# EAGLE design myQT_nRF52840_Board (EAGLE 9.6.2)
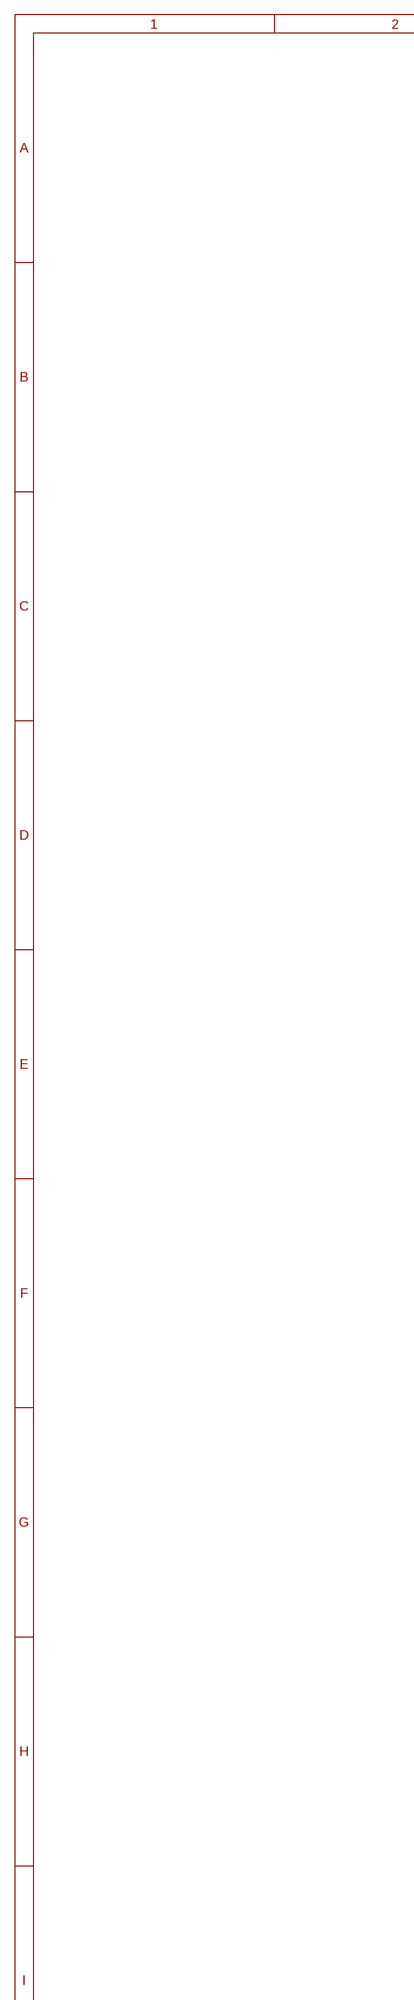
[diagram p0: schematic, sheet 1, part 1 of 2]
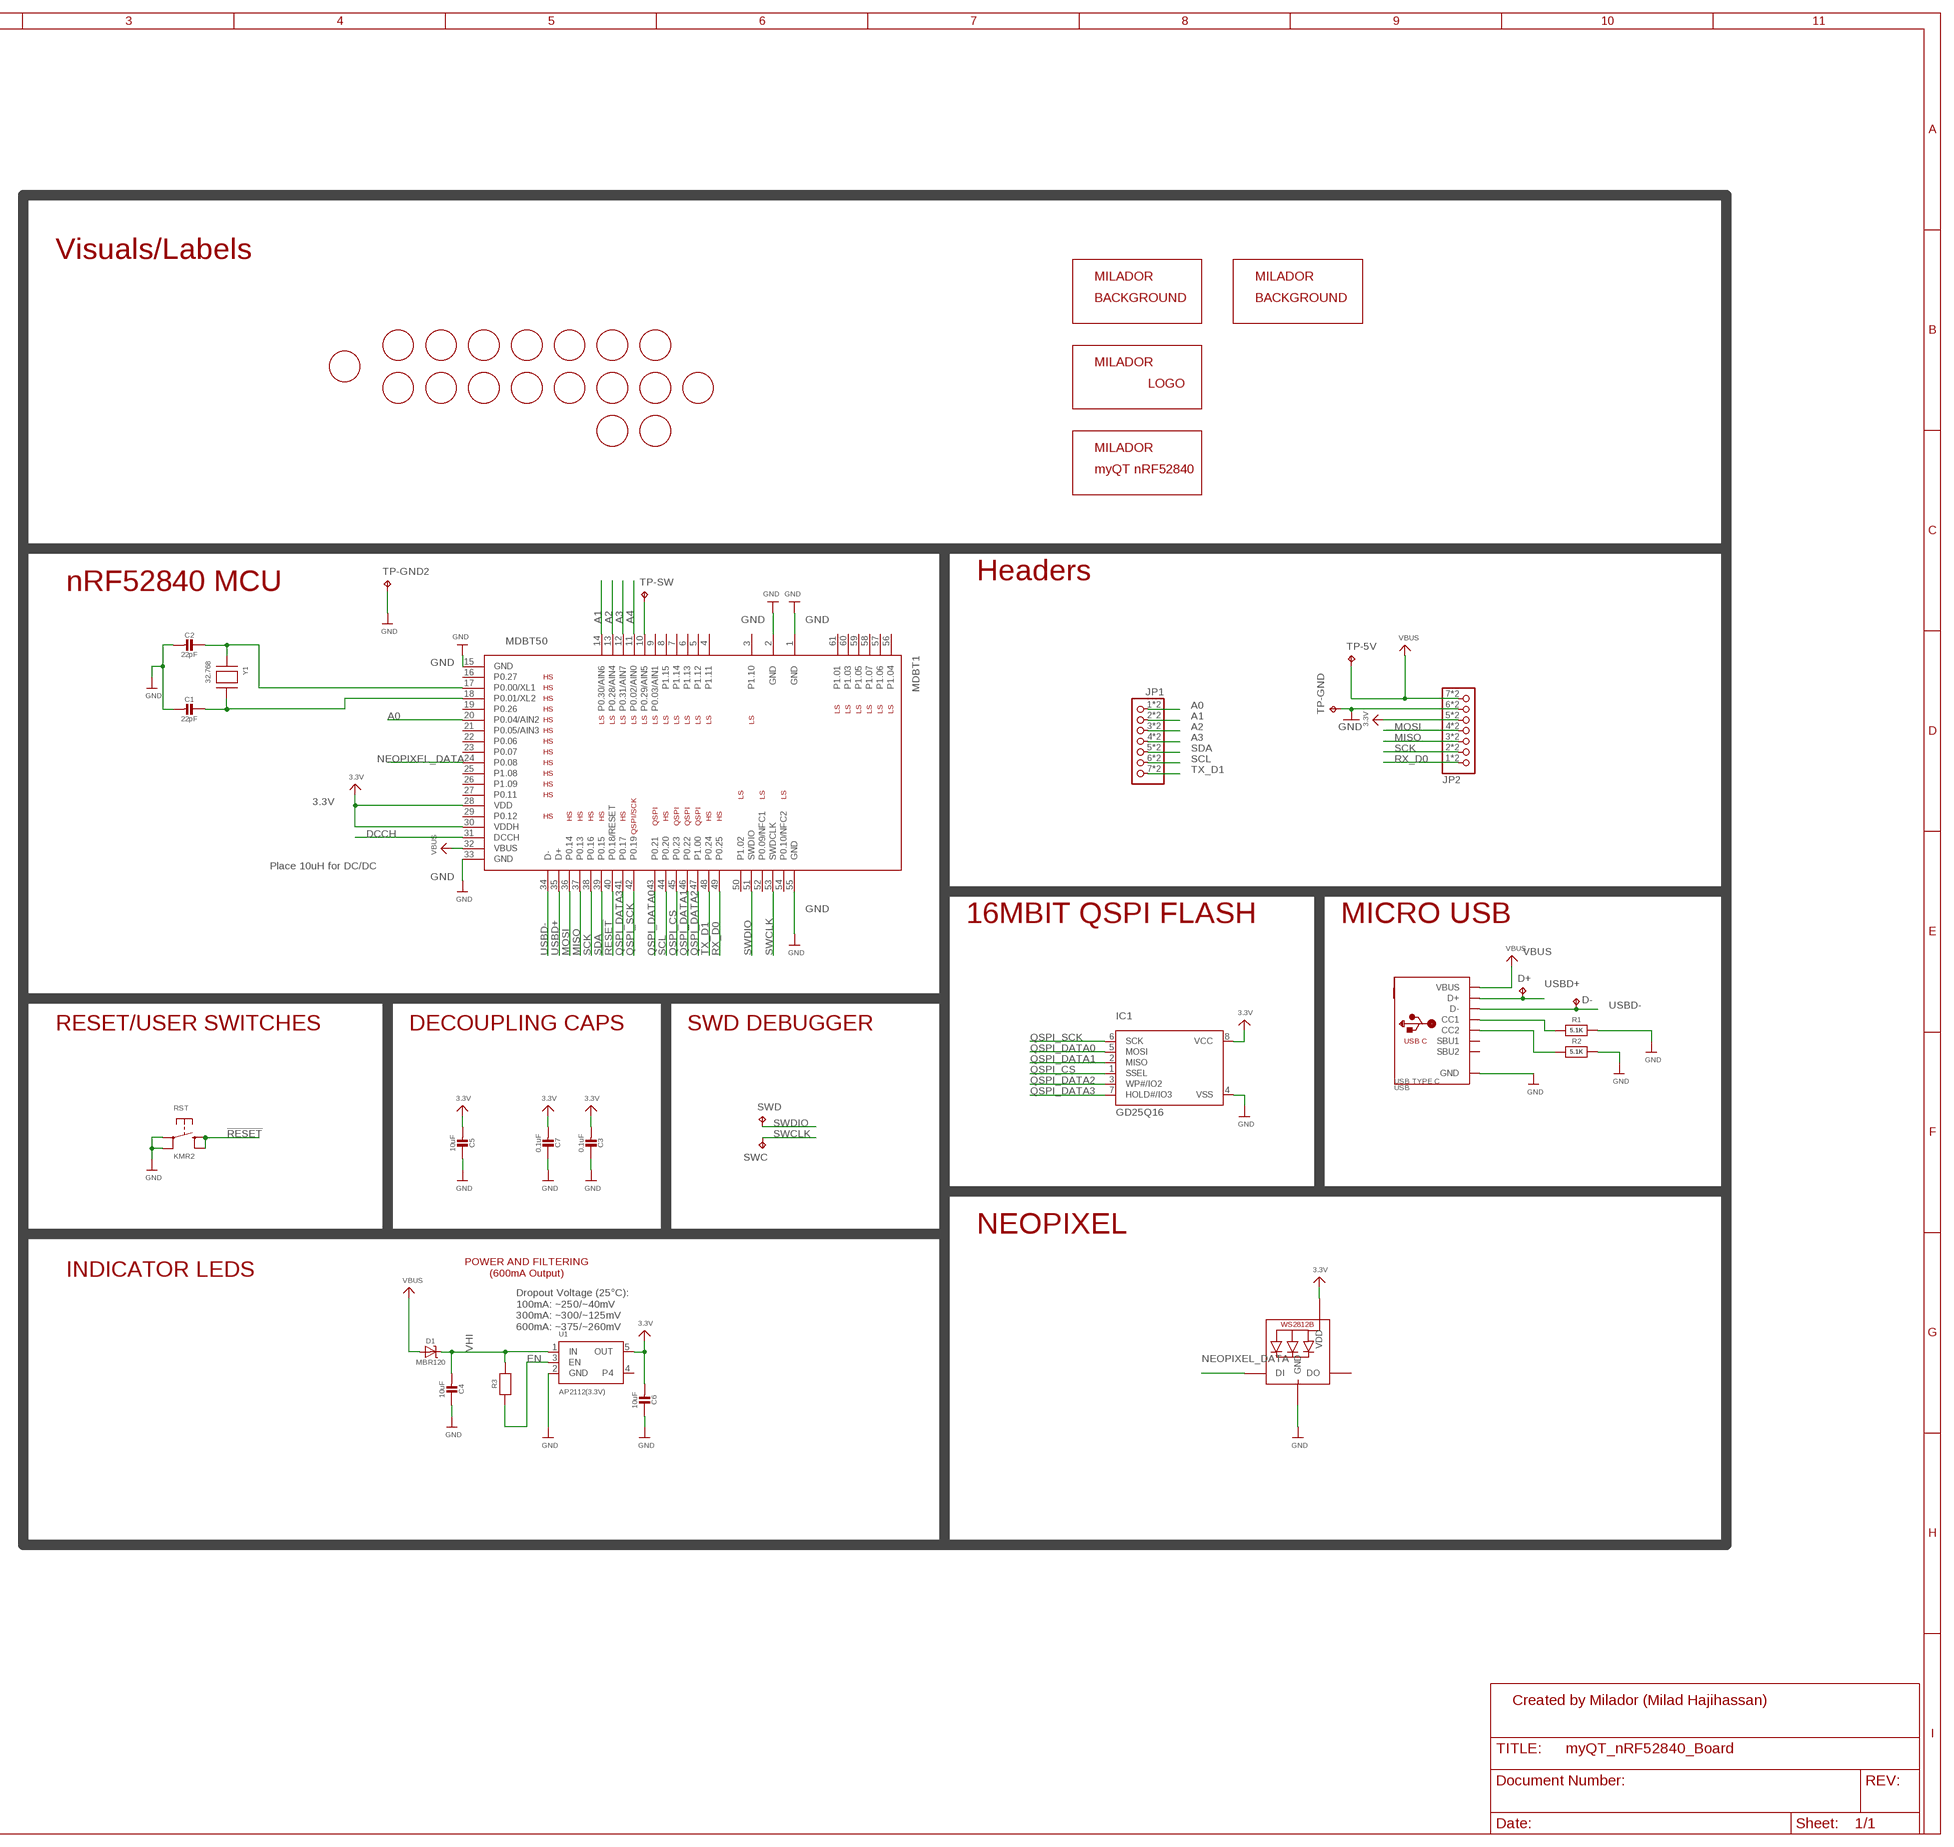
[diagram p1: schematic, sheet 1, part 2 of 2]

## Parts
C1  22pF  CAP_CERAMIC-0603MP  [0603-MP]
C2  22pF  CAP_CERAMIC-0603MP  [0603-MP]
C3  0.1uF  CAP_CERAMIC-0603-NO  [0603-NO]
C4  10uF  CAP_CERAMIC-0805-NOOUTLINE  [0805-NO]
C5  10uF  CAP_CERAMIC-0805-NOOUTLINE  [0805-NO]
C6  10uF  CAP_CERAMIC-0805-NOOUTLINE  [0805-NO]
C7  0.1uF  CAP_CERAMIC-0603-NO  [0603-NO]
D1  MBR120  DIODE-SCHOTTKYSOD-123  [SOD-123]
D+  TESTPAD_TPTP10R  [TESTPAD_TP10R]
D-  TESTPAD_TPTP10R  [TESTPAD_TP10R]
IC1  GD25Q16  SPIFLASH_8PINUX  [USON8]
JP1  HEADER-1X7_CASTEL  [1X07_CASTEL]
JP2  HEADER-1X7_CASTEL  [1X07_CASTEL]
LED  WS2812B_SK6805_1515  [SK6805_1515]
MDBT1  MDBT50  [MDBT50]
R1  5.1K  RESISTOR-0402-NO  [0402-NO]
R2  5.1K  RESISTOR-0402-NO  [0402-NO]
R3  10K  RESISTOR-0603-NOOUT  [0603-NO]
RST  KMR2  SWITCH_TACT_SMT4.6X2.8  [BTN_KMR2_4.6X2.8]
SWC  TESTPAD_TPTP13R  [TESTPAD_TP13R]
SWD  TESTPAD_TPTP13R  [TESTPAD_TP13R]
TP-5V  TESTPAD_TPB1,27  [TESTPAD_B1,27]
TP-GND  TESTPAD_TPB1,27  [TESTPAD_B1,27]
TP-GND2  TESTPAD_TPTP06R  [TESTPAD_TP06R]
TP-SW  TESTPAD_TPTP06R  [TESTPAD_TP06R]
U1  AP2112(3.3V)  VREG_SOT23-5  [SOT23-5]
U$6  MILADOR-PIN-NAME-A0  [PIN-A0]
U$7  MILADOR-PIN-NAME-5V  [PIN-5V]
U$10  MILADOR-PIN-NAME-GND  [PIN-GND]
U$12  MILADOR-PIN-NAME-3V  [PIN-3V]
U$14  MILADOR-PIN-NAME-MO2  [PIN-MO2]
U$18  MILADOR-PIN-NAME-MI2  [PIN-MI2]
U$20  MILADOR-PIN-NAME-SCK2  [PIN-SCK2]
U$24  MILADOR-PIN-NAME-RX  [PIN-RX]
U$25  MILADOR-PIN-NAME-A1  [PIN-A1]
U$26  MILADOR-PIN-NAME-A2  [PIN-A2]
U$27  MILADOR-PIN-NAME-A3  [PIN-A3]
U$28  MILADOR-PIN-NAME-TX  [PIN-TX]
U$29  MILADOR-PIN-NAME-SDA2  [PIN-SDA2]
U$33  MILADOR-PIN-NAME-SCL2  [PIN-SCL2]
U$36  MILADOR-PIN-NAME-RST  [PIN-RST]
U$37  MILADOR-BACKGROUND-VANCOUVER  [MILADOR_BG_VAN]
U$38  MILADOR-DEVICE-  [MILADOR_MYQT_NRF52840]
U$39  MILADOR-LOGO-  [MILADOR_LOGO1]
U$40  MILADOR-BACKGROUND-CANADA_SM  [MILADOR_BG_CAN_SM]
U$41  MILADOR-PIN-NAME-D+  [PIN-D+]
U$43  MILADOR-PIN-NAME-D-  [PIN-D-]
U$44  MILADOR-PIN-NAME-SW  [PIN-SW]
USB  USB TYPE C  USB_C  [USB_C_CUSB31-CFM2AX-01-X]
Y1  32.768  ADAFRUIT2_XTAL-3.2X1.5  [ADAFRUIT2_XTAL3215]

## Nets
3.3V [power]: C3.2 C5.2 C6.2 C7.2 IC1.8(VCC) JP2.5 JP2.5C LED.2(VDD) MDBT1.28(VDD) MDBT1.30(VDDH) U1.5(OUT)
!RESET: MDBT1.40(P0.18/RESET) RST.B'(S1) RST.B(S)
A0: JP1.1 JP1.1C MDBT1.20(P0.04/AIN2)
A1: JP1.2 JP1.2C MDBT1.14(P0.30/AIN6)
A2: JP1.3 JP1.3C MDBT1.13(P0.28/AIN4)
A3: JP1.4 JP1.4C MDBT1.12(P0.31/AIN7)
A4: MDBT1.11(P0.02/AIN0)
DCCH: MDBT1.31(DCCH)
EN: R3.1 U1.3(EN)
GND [power]: C1.2 C2.2 C3.1 C4.1 C5.1 C6.1 C7.1 IC1.4(VSS) JP2.6 JP2.6C LED.4(GND) MDBT1.1(GND) MDBT1.2(GND) MDBT1.15(GND) MDBT1.33(GND) MDBT1.55(GND) R1.2 R2.2 RST.A'(P1) RST.A(P) TP-GND2.TP TP-GND.TP U1.2(GND) USB.A1B12(GND) USB.B1A12(GND)
MISO: JP2.3 JP2.3C MDBT1.37(P0.13)
MOSI: JP2.4 JP2.4C MDBT1.36(P0.14)
N$1: MDBT1.10(P0.29/AIN5) TP-SW.TP
N$3: R1.1 USB.A5(CC1)
N$4: R2.1 USB.B5(CC2)
N$7: C2.1 MDBT1.17(P0.00/XL1) Y1.P$1
N$8: C1.1 MDBT1.18(P0.01/XL2) Y1.P$2
NEOPIXEL_DATA: LED.1(DI) MDBT1.24(P0.08)
QSPI_CS: IC1.1(SSEL) MDBT1.45(P0.23)
QSPI_DATA0: IC1.5(MOSI) MDBT1.43(P0.21)
QSPI_DATA1: IC1.2(MISO) MDBT1.46(P0.22)
QSPI_DATA2: IC1.3(WP#/IO2) MDBT1.47(P1.00)
QSPI_DATA3: IC1.7(HOLD#/IO3) MDBT1.41(P0.17)
QSPI_SCK: IC1.6(SCK) MDBT1.42(P0.19)
RX_D0: JP2.1 JP2.1C MDBT1.49(P0.25)
SCK: JP2.2 JP2.2C MDBT1.38(P0.16)
SCL: JP1.6 JP1.6C MDBT1.44(P0.20)
SDA: JP1.5 JP1.5C MDBT1.39(P0.15)
SWCLK: MDBT1.53(SWDCLK) SWC.TP
SWDIO: MDBT1.51(SWDIO) SWD.TP
TX_D1: JP1.7 JP1.7C MDBT1.48(P0.24)
USBD+: D+.TP MDBT1.35(D+) USB.A6(D+) USB.B6(D+)
USBD-: D-.TP MDBT1.34(D-) USB.A7(D-) USB.B7(D-)
VBUS [power]: D1.A JP2.7 JP2.7C MDBT1.32(VBUS) TP-5V.TP USB.A4B9(VBUS) USB.B4A9(VBUS)
VHI [power]: C4.2 D1.C R3.2 U1.1(IN)
Unconnected: LED.3(DO) MDBT1.3(P1.10) MDBT1.4(P1.11) MDBT1.5(P1.12) MDBT1.6(P1.13) MDBT1.7(P1.14) MDBT1.8(P1.15) MDBT1.9(P0.03/AIN1) MDBT1.16(P0.27) MDBT1.19(P0.26) MDBT1.21(P0.05/AIN3) MDBT1.22(P0.06) MDBT1.23(P0.07) MDBT1.25(P1.08) MDBT1.26(P1.09) MDBT1.27(P0.11) MDBT1.29(P0.12) MDBT1.50(P1.02) MDBT1.52(P0.09/NFC1) MDBT1.54(P0.10/NFC2) MDBT1.56(P1.04) MDBT1.57(P1.06) MDBT1.58(P1.07) MDBT1.59(P1.05) MDBT1.60(P1.03) MDBT1.61(P1.01) U1.4 USB.A8(SBU1) USB.B8(SBU2)

## Notes on the sheet
- Visuals/Labels
- Headers
- nRF52840 MCU
- Place 10uH for DC/DC
- 16MBIT QSPI FLASH | MICRO USB
- RESET/USER SWITCHES | DECOUPLING CAPS | SWD DEBUGGER
- NEOPIXEL
- INDICATOR LEDS
- POWER AND FILTERING
  (600mA Output)
- Dropout Voltage (25°C):
  100mA: ~250/~40mV
  300mA: ~300/~125mV
  600mA: ~375/~260mV
- Created by Milador (Milad Hajihassan)

## Library data of the parts
C1-C7 = milador_SMD:CAP_CERAMIC-: Ceramic Capacitors For new designs, use the packages preceded by an '_' character since they are more reliable: The following footprints should be used on most boards: _0402 - Standard footprint for regular board layouts _0603 - Standard footprint for regular board layouts _0805 - Standard footprint for regular board layouts _1206 - Standard footprint for regular board layouts For extremely tight-pitch boards where space is at a premium, the following 'micro-pitch' footprints can be used (smaller pads, no silkscreen outline, etc.): _0402MP - Micro-pitch footprint for very dense/compact boards _0603MP - Micro-pitch footprint for very dense/compact boards _0805MP - Micro-pitch footprint for very dense/compact boards _1206MP - Micro-pitch footprint for very dense/compact boards
D1 = milador_SMD:DIODE-SCHOTTKY
D+ D- SWC SWD TP-5V TP-GND TP-GND2 TP-SW = milador_SMD:TESTPAD_TP: Test pad
IC1 = milador_SMD:SPIFLASH_8PIN: SOIC8 SPI Flash Be careful with the size since SOIC8 flash comes in several 'widths' SOIC8 150 mil M25P16 - 16Mbit (2Mbit x 8) Serial Flash (75MHz SPI Bus), Supply: 2.7-3.6V Digikey: SOIC8 - M25P16-VMN6P-ND SOIC8 208 mil W25Q16BVSSIG - 16Mbit (2Mbit x 8) Serial Flash (104MHz SPI Bus), Supply: 2.7-3.6V Digikey: SOIC8 - W25Q16BVSSIG-ND
JP1 JP2 = milador:HEADER-1X7: PIN HEADER
LED = milador_SMD:WS2812B
MDBT1 = milador_SMD:MDBT50: Raytac Corporation MDBT50 Bluetooth Low Energy Module based on Noridc nRF52840 Source: Raytac datasheet
R1-R3 = milador_SMD:RESISTOR-: Resistors For new designs, use the packages preceded by an '_' character since they are more reliable: The following footprints should be used on most boards: _0402 - Standard footprint for regular board layouts _0603 - Standard footprint for regular board layouts _0805 - Standard footprint for regular board layouts _1206 - Standard footprint for regular board layouts For extremely tight-pitch boards where space is at a premium, the following 'micro-pitch' footprints can be used (smaller pads, no silkscreen outline, etc.): _0402MP - Micro-pitch footprint for very dense/compact boards _0603MP - Micro-pitch footprint for very dense/compact boards _0805MP - Micro-pitch footprint for very dense/compact boards _1206MP - Micro-pitch footprint for very dense/compact boards
RST = milador_SMD:SWITCH_TACT_SMT: SMT Tact Switches 6x6mm - Digikey: P12940SCT-ND KMR2 (4.6x2.8mm) - Digikey: 401-1426-1-ND EVQ-PQHB55 - Light Touch, 160GF (4.5x4.5mm) - Digikey: P8090SCT-ND KMT0 - KMT021 NGJ LHS (etc.) IP68/Waterproof - Digikey: CKN10289CT-ND
U1 = milador_SMD:VREG_SOT23-5: SOT23-5 Fixed Voltage Regulators Part Current Out V Out V In V Dropout θJA (°C/W) TJ (°C) Digikey Part No. ADP121 150mA 3.3V 3.4-5.5V 0.09V @ 150mA -- -- ADP121-AUJZ33R7CT-ND ADP121 150mA 3.0V 3.1-5.5V 0.09V @ 150mA -- -- ADP121-AUJZ30R7CT-ND ADP122 300mA 3.3V 3.4-5.5V 0.085V @ 300mA -- -- ADP122AUJZ-3.3-R7CT-ND ADP1712 300mA 3.3V 3.5-5.5V 0.17V @ 300mA -- -- ADP1712AUJZ-3.3-R7TR-ND AP7311 (Low Cost) 150mA 3.3V 3.5-6V 0.15V @ 150mA -- -- AP7311-33WG-7DICT-ND LD39015M18R 150mA 1.8V 1.9V-5.5V 0.08V @ 100mA -- -- 497-6977-1-ND LP2985A-33DBVR 150mA 3.3V 3.3-16V 0.28V @ 150mA 206 150 296-18479-1-ND MCP1824T-3302E/OT 300mA 3.3V 3.5V-6V 0.2V @ 300mA -- -- MCP1824T-3302E/OTCT-ND MIC5205-2.5YM5 TR 150mA 2.5V 2.7-16V 0.165V @ 150mA -- -- 576-1257-2-ND MIC5205-3.0YM5 TR 150mA 3.0V 3.2V-16V 0.165V @ 150mA -- -- 576-1258-2-ND MIC5205-3.3YM5 TR 150mA 3.3V 3.5V-16V 0.165V @ 150mA -- -- 576-1259-2-ND TPS780330220 150mA 3.3V+2.2V 3.6-5.5V 250mV Max -- -- 296-23332-1-ND TDA3663/N1,135 100mA 3.3V 3.5-45V 0.18V @ 50mA -- -- 568-5343-1-ND Max operating temp can be calculated using θJA, TJ (max junction temperature), and power in watts. Set the "Maximum Ambient Temperature" until it reaches TJ ("Max Junction Temperature"), which is the absolute limit for safe use of the regulator: Heat Sink Temperature Calculator <http://www.daycounter.com/Calculators/Heat-Sink-Temperature-Calculator.phtml> For example, With 12V source into a 3.3V LP2985 and a 30mA load, we are dissipating (12V-3.3V) * 0.03A = 0.261W. With a θJA of 206 °C/W, a TJ of 150°C, and 261mW we can safely use the chip without a heat sink up to 75°C (=147.1°C Junction Temperature).
U$6 U$7 U$10 U$12 U$14 U$18 U$20 U$24-U$29 U$33 U$36 U$41 U$43 U$44 = milador:MILADOR-PIN-NAME-
U$37 U$40 = milador:MILADOR-BACKGROUND-
U$38 = milador:MILADOR-DEVICE-
U$39 = milador:MILADOR-LOGO-
USB = milador_SMD:USB_C: USB Type-C USB 2.0 Connector
Y1 = milador_SMD:ADAFRUIT2_XTAL: Low cost SMT crystals, no capacitors included http://www.ladyada.net/library/eagle

## Net classes
1 power: width 0.254 mm

## Board
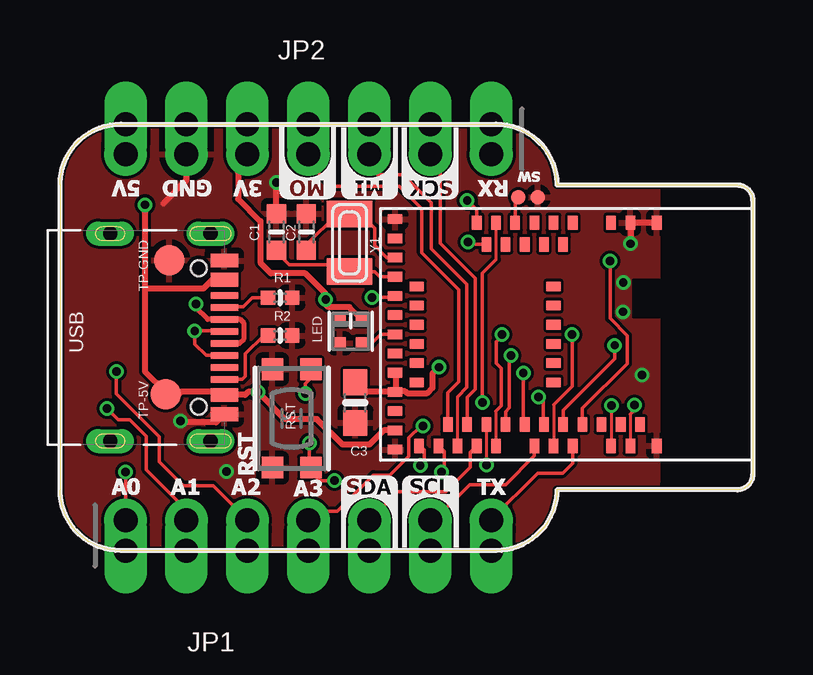
[diagram p2: board, top side]
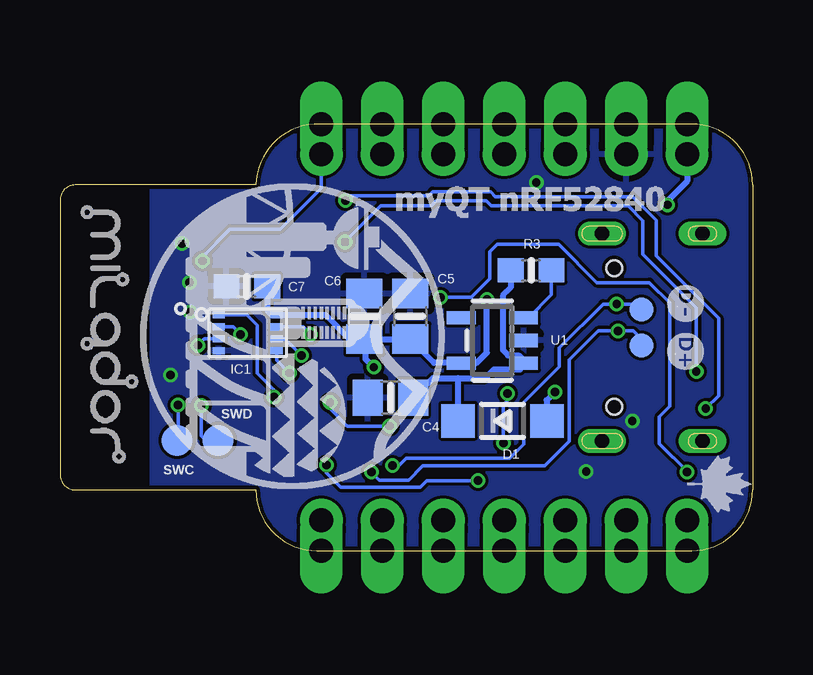
[diagram p3: board, bottom side, seen from below]

Size 28.86 x 17.78 mm. Coordinates in mm from the lower left corner, seen from the top.
Outline: 0,15.24 arc-90 2.54,17.78 18.03,17.78 arc-90 20.7,15.24 28.23,15.24 arc-90 28.86,14.61 28.86,3.17 arc-90 28.23,2.54 20.7,2.54 arc-90 18.16,0 2.54,0 arc-90 0,2.54 0,15.24
Copper layers (1*16): Top 0.035mm / dielectric 1.5mm / Bottom 0.035mm
Design rules "SparkFun-2-Layer-Minimum-JLCPCB": minimum track width 5mil, minimum drill 0.3mm, track to track 5mil, track to pad 5mil, pad to pad 5mil, via to via 5mil, smd to smd 5mil, copper to edge 7mil, drill to drill 7mil, minimum pad ring 5mil, minimum via ring 5mil, stop-mask expansion 2.5mil, vias tented up to drill 25mil, thermal gap 10mil

### Footprints (pad centres in the part's own frame; a part is rotated, then mirrored left to right if it is on the bottom)
0603-MP = smd 0.8 x 0.8: 1 -0.762,0; 2 0.762,0
0603-NO = smd 1.075 x 1: 1 -0.85,0; 2 0.85,0
0805-NO = smd 1.24 x 1.5: 1 -0.95,0; 2 0.95,0
SOD-123 = smd 1.4 x 1.4: A 1.85,0; C -1.85,0
TESTPAD_TP10R = smd 1 x 1: TP 0,0
USON8 = smd 0.5 x 0.275: 1 -1.2,0.75; 2 -1.2,0.25; 3 -1.2,-0.25; 4 -1.2,-0.75; 5 1.2,-0.75; 6 1.2,-0.25; 7 1.2,0.25; 8 1.2,0.75
1X07_CASTEL = drill 1 pad 1.778: 1 -7.62,0; 2 -5.08,0; 3 -2.54,0; 4 0,0; 5 2.54,0; 6 5.08,0; 7 7.62,0 | drill 1 pad 1.778 long: 1C -7.62,-1.27; 2C -5.08,-1.27; 3C -2.54,-1.27; 4C 0,-1.27; 5C 2.54,-1.27; 6C 5.08,-1.27; 7C 7.62,-1.27
SK6805_1515 = smd 0.5 x 0.5: 1 -0.5,-0.45; 2 0.5,-0.45; 3 0.5,0.45; 4 -0.5,0.45
MDBT50 = smd 0.6 x 0.4: 1 -4.65,3.75; 2 -4.65,2.65; 3 -4.65,1.85; 4 -4.65,0.25; 5 -3.75,-0.15; 6 -4.65,-0.55; 7 -3.75,-0.95; 8 -4.65,-1.35; 9 -3.75,-1.75; 10 -4.65,-2.15; 11 -3.75,-2.55; 12 -4.65,-2.95; 13 -3.75,-3.35; 14 -4.65,-3.75; 34 4.65,-6.15; 35 4.65,-5.35; 36 3.75,-4.95; 37 4.65,-4.55; 38 3.75,-4.15; 39 4.65,-3.75; 40 3.75,-3.35; 41 4.65,-2.95; 42 3.75,-2.55; 43 3.75,-1.75; 44 4.65,-1.35; 45 3.75,-0.95; 46 4.65,-0.55; 47 3.75,-0.15; 48 4.65,0.25; 49 3.75,0.65; 50 3.75,1.45; 51 4.65,1.85; 52 3.75,2.25; 53 4.65,2.65; 54 3.75,3.05; 55 4.65,3.75 | smd 0.4 x 0.6: 15 -4.8,-7.15; 16 -4,-7.15; 17 -3.2,-7.15; 18 -2.4,-7.15; 19 -2,-6.25; 20 -1.6,-7.15; 21 -1.2,-6.25; 22 -0.8,-7.15; 23 -0.4,-6.25; 24 0,-7.15; 25 0.4,-6.25; 26 0.8,-7.15; 27 1.2,-6.25; 28 1.6,-7.15; 29 2,-6.25; 30 2.4,-7.15; 31 3.2,-7.15; 32 4,-7.15; 33 4.8,-7.15; 56 -2,-0.55; 57 -1.2,-0.55; 58 -0.4,-0.55; 59 0.4,-0.55; 60 1.2,-0.55; 61 2,-0.55
0402-NO = smd 0.6 x 0.6: 1 -0.508,0; 2 0.508,0
BTN_KMR2_4.6X2.8 = smd 0.9 x 0.9: A 2.05,0.8; A' -2.05,0.8; B 2.05,-0.8; B' -2.05,-0.8
TESTPAD_TP13R = smd 1.3 x 1.3: TP 0,0
TESTPAD_B1,27 = smd 1.27 x 1.27: TP 0,0
TESTPAD_TP06R = smd 0.6 x 0.6: TP 0,0
SOT23-5 = smd 0.55 x 1.2: 1 -0.95,-1.3; 2 0,-1.3; 3 0.95,-1.3; 4 0.95,1.3; 5 -0.95,1.3
USB_C_CUSB31-CFM2AX-01-X = smd 0.575 x 1.15: A1B12 -3.2,3.545; A4B9 -2.4,3.545; B1A12 3.2,3.545; B4A9 2.4,3.545 | smd 0.275 x 1.15: A5 -1.25,3.545; A6 -0.25,3.545; A7 0.25,3.545; A8 1.25,3.545; B5 1.75,3.545; B6 0.75,3.545; B7 -0.75,3.545; B8 -1.75,3.545 | drill 0.6 pad 1 long: M1 -4.32,2.97; M2 4.32,2.97; M3 -4.32,-1.21; M4 4.32,-1.21 | hole 0.65: 2.89,2.47; -2.89,2.47
ADAFRUIT2_XTAL3215 = smd 1.1 x 1.9: P$1 1.2,0; P$2 -1.2,0

### Placement (x,y rotation side)
C1  9.02,13.28 90 top
C2  10.27,13.28 90 top
C3  12.31,6.17 90 top
C4  15.09,6.38 0 bottom
C5  14.27,9.77 270 bottom
C6  16.17,9.77 270 bottom
C7  21.08,11.01 0 bottom
D1  10.42,5.41 0 bottom
D+  4.62,8.56 0 bottom
D-  4.62,10.06 0 bottom
IC1  21.04,9.08 0 bottom
JP1  10.35,1.27 0 top
JP2  10.35,16.51 180 top
LED  12.12,9.14 90 top
MDBT1  21.11,9.02 270 top
R1  9.17,10.54 0 top
R2  9.17,8.97 0 top
R3  9.23,11.69 180 bottom
RST  9.65,5.51 90 top
SWC  23.98,4.6 270 bottom
SWD  22.27,4.6 0 bottom
TP-5V  4.4,6.52 0 top
TP-GND  4.55,12.1 0 top
TP-GND2  19.91,14.73 0 top
TP-SW  19.1,14.73 0 top
U1  10.85,8.76 90 bottom
U$6  2.73,2.34 0 top
U$7  2.72,15.44 180 top
U$10  5.28,15.44 180 top
U$12  7.8,15.44 180 top
U$14  10.3,15.44 180 top
U$18  12.87,15.44 180 top
U$20  15.43,15.44 180 top
U$24  18.03,15.44 180 top
U$25  5.21,2.34 0 top
U$26  7.75,2.34 0 top
U$27  10.34,2.26 0 top
U$28  17.97,2.34 0 top
U$29  12.89,2.34 0 top
U$33  15.43,2.34 0 top
U$36  8.1,4.06 90 top
U$37  19.05,8.89 270 bottom
U$38  9.32,14.12 0 bottom
U$39  27.97,8.89 270 bottom
U$40  2.74,2.77 270 bottom
U$41  3.56,8.31 270 bottom
U$43  3.56,10.31 270 bottom
U$44  19.54,15.8 180 top
USB  3.3,8.89 270 top
Y1  12.06,12.83 90 top

### Tracks (layer width: path | path; a pad name or v marks a point on that pad's centre or on a via)
3.3V  (via drill 0.35)
  Top 0.254: v15.79,7.65 15.52,7.38 15.52,6.78 15.3,6.56 14.46,6.56 14.38,6.64 13.99,6.64 | JP2.5C JP2.5 7.81,16.17 7.42,15.77 7.42,14.66 8.34,13.73 8.34,12 8.79,11.56 10.23,11.56 11.07,10.71 v11.07,10.46 11.07,10.26 11.18,10.15 12.06,10.15 LED.2 | 13.99,6.64 MDBT1.30 12.71,6.62 C3.2 | MDBT1.28 13.99,7.39 13.99,6.64
  Bottom 0.254: 16.07,8.82 C6.2 16.78,8.82 17.8,9.83 IC1.8 20.03,9.83 20.23,10.03 C7.2 | 16.07,8.82 C5.2 13.27,7.82 12.16,7.82 U1.5 11.52,7.81 11.07,8.26 v11.07,10.46 | v15.79,7.65 16.13,7.99 16.13,8.75 16.07,8.82
!RESET  (via drill 0.35)
  Top 0.127: MDBT1.40 v17.76,3.57
  Top 0.152: v11.44,2.92 10.82,2.92 10.45,3.29 RST.B' 10.39,3.52 v10.39,4.49 | v10.22,6.55 10.22,6.95 10.45,7.18 RST.B
  Bottom 0.152: v17.76,3.57 17.76,3.25 17.16,2.65 13.84,2.65 13.58,2.92 v11.44,2.92 | v10.22,6.55 10.22,6.24 10.39,6.08 v10.39,4.49
A0  (via drill 0.35)
  Top 0.152: v2.73,3.28 JP1.1 JP1.1C | MDBT1.20 13.9,10.55 v13.01,10.55
  Bottom 0.152: v2.73,3.28 2.73,3.3 3.89,4.46 3.89,5.59 3.45,6.02 3.45,10.33 4.3,11.18 6.5,11.18 8.09,12.76 10.64,12.76 10.95,12.46 10.95,11.34 11.73,10.55 v13.01,10.55
A1  (via drill 0.35)
  Top 0.152: v1.96,5.93 2.43,5.46 2.91,5.46 3.59,4.78 3.59,3.38 5.27,1.7 JP1.2 JP1.2C | MDBT1.14 17.36,14.2 v16.97,14.6
  Bottom 0.152: v1.96,5.93 1.42,6.46 1.42,9.69 4.03,12.29 4.03,13.78 5,14.76 10.72,14.76 10.92,14.96 13.34,14.96 13.5,14.8 16.78,14.8 v16.97,14.61 v16.97,14.6
A2  (via drill 0.35)
  Top 0.152: MDBT1.13 17.09,12.77 v16.99,12.87 | v2.35,7.47 2.35,6.54 4.14,4.75 4.14,3.71 5.13,2.72 6.38,2.72 7.81,1.28 JP1.3C JP1.3
  Bottom 0.152: v16.99,12.87 15.49,14.36 13.4,14.36 13.18,14.58 11.1,14.58 10.9,14.38 5.19,14.38 4.57,13.76 4.57,12.34 2.35,10.12 v2.35,7.47
A3  (via drill 0.35)
  Top 0.127: MDBT1.12 18.16,12.13
  Top 0.152: 18.16,12.13 17.6,11.57 v17.6,6.18 | v15.13,5.19 15.02,5.19 14.53,4.7 14.53,3.94 13.74,3.15 13.06,3.15 11.56,1.65 10.73,1.65 JP1.4 JP1.4C
  Bottom 0.152: v15.13,5.19 16.89,5.19 17.6,5.91 v17.6,6.18
EN
  Bottom 0.152: R3.1 8.38,10.66 9.33,9.71 U1.3
GND  (via drill 0.35)
  Top 0.254: MDBT1.1 MDBT1.2 23.78,13.65 v23.78,12.79 23.76,12.78 | JP2.6C 5.27,15.43 4.3,14.46 | C1.2 v9.02,15.34 | USB.B1A12 6.5,5.35 5.07,5.35 v5.02,5.4
  other vias: 6.93,3.3 23.47,11.18 23.45,9.96 24.25,7.33
  pour Bottom: 0,17.78 25.05,17.78 25.05,0 0,0
  pour Top: 0,17.78 25.05,17.78 25.05,0 0,0
MISO
  Top 0.127: MDBT1.37 16.56,6.42
  Top 0.152: JP2.3C JP2.3 12.89,16 13.23,15.66 14.3,15.66 15.47,14.49 15.47,12.59 16.95,11.1 16.95,6.81 16.56,6.42
MOSI
  Top 0.152: JP2.4C JP2.4 10.35,16.16 11.32,15.19 14.13,15.19 15.07,14.25 15.07,12.42 16.61,10.88 16.61,7.04 16.16,6.59 MDBT1.36
N$1
  Top 0.152: MDBT1.10 18.97,13.68 18.97,14.61 TP-SW.TP
N$3
  Top 0.152: USB.A5 6.87,10.16 7.63,10.16 8.01,10.54 R1.1
N$4
  Top 0.152: R2.1 8.48,8.97 7.72,8.21 7.72,7.27 7.6,7.14 USB.B5
N$7
  Top 0.152: MDBT1.17 13.62,12.22 13.12,12.72 13.12,13.44 12.54,14.03 Y1.P$1 11.54,14.03 10.27,12.75 C2.1
N$8
  Top 0.152: C1.1 9.02,12.45 9.56,11.91 11.6,11.91 11.87,11.63 Y1.P$2 13.11,11.63 13.32,11.42 MDBT1.18
NEOPIXEL_DATA
  Top 0.152: LED.1 13,8.64 13.37,9.02 MDBT1.24
QSPI_CS  (via drill 0.35)
  Top 0.152: MDBT1.45 20.13,5.3 20.13,6.22 v19.94,6.41
  Bottom 0.152: IC1.1 21.07,9.83 20.64,9.4 20.64,7.39 19.94,6.69 v19.94,6.41
QSPI_DATA0  (via drill 0.35)
  Top 0.152: MDBT1.43 19.3,5.33 v19.3,7.4
  Bottom 0.152: IC1.5 19.84,7.94 v19.3,7.4
QSPI_DATA1  (via drill 0.35)
  Top 0.127: 20.56,6.09 MDBT1.46
  Top 0.152: v21.34,9.02 21.34,6.86 20.56,6.09
  Bottom 0.152: IC1.2 21.65,9.33 v21.34,9.02
QSPI_DATA2  (via drill 0.35)
  Top 0.152: v23.11,8.56 23.11,8 20.96,5.85 MDBT1.47
  Bottom 0.152: IC1.3 22.84,8.83 v23.11,8.56
QSPI_DATA3  (via drill 0.35)
  Top 0.127: 18.16,5.82 MDBT1.41
  Top 0.152: v18.41,9.02 18.41,8.95 18.18,8.71 18.18,7.81 18.39,7.59 18.39,6.04 18.16,5.82
  Bottom 0.152: IC1.7 18.73,9.33 v18.41,9.02
QSPI_SCK  (via drill 0.35)
  Top 0.152: MDBT1.42 18.56,5.8 18.72,5.96 18.72,8.05 v18.8,8.13
  Bottom 0.152: IC1.6 19.5,8.83 v18.8,8.13
RX_D0  (via drill 0.35)
  Top 0.152: MDBT1.49 21.76,5.93 23.64,7.8 23.64,8.97 22.92,9.68 v22.92,12.06
  Bottom 0.152: v22.92,12.06 22.92,12.26 21.78,13.4 19.68,13.4 17.97,15.11 JP2.1 JP2.1C
SCK
  Top 0.152: MDBT1.38 16.96,6.38 17.3,6.72 17.3,11.35 15.85,12.8 15.85,15.79 15.43,16.21 JP2.2 JP2.2C
SCL
  Top 0.152: MDBT1.44 19.76,3.95 18.57,2.76 17.07,2.76 15.58,1.27 JP1.6 JP1.6C
SDA
  Top 0.152: MDBT1.39 17.1,4.1 17.1,3.48 16.08,2.46 14.07,2.46 12.89,1.28 JP1.5 JP1.5C
SWCLK  (via drill 0.35)
  Top 0.127: 23.76,5.68 MDBT1.53
  Top 0.152: v23.94,6.07 23.94,5.86 23.76,5.68 | MDBT1.53
  Bottom 0.152: v23.94,6.07 v23.93,6.06 23.93,4.65 SWC.TP
SWDIO  (via drill 0.35)
  Top 0.127: v22.97,6.06 22.97,4.38
  Top 0.152: MDBT1.51 22.97,4.38
  Bottom 0.152: SWD.TP 22.78,4.6 22.97,4.8 v22.97,6.06
TX_D1
  Top 0.152: MDBT1.48 21.36,3.65 20.95,3.24 19.9,3.24 17.97,1.31 JP1.7 JP1.7C
USBD+  (via drill 0.35)
  Top 0.152: USB.B6 6.08,8.14 5.61,8.61 v5.61,9.16 6.83,9.16 USB.A6 | MDBT1.35 15.79,4.37 16.02,4.14 16.02,3.41 v15.89,3.28
  Bottom 0.152: v15.89,3.28 15.56,2.95 14.33,2.95 13.74,3.53 8.66,3.53 7.63,4.56 7.63,7.96 6.44,9.16 v5.61,9.16 4.98,9.16 4.62,8.8 D+.TP
USBD-  (via drill 0.35)
  Top 0.152: MDBT1.34 15.02,4.37 15.17,4.21 15.17,3.71 v15.01,3.56
  Top 0.203: v5.66,10.28 5.66,10.12 6.15,9.64 USB.B7 7.5,9.64 7.67,9.47 7.67,8.84 7.47,8.64 USB.A7
  Bottom 0.152: v15.01,3.56 14.73,3.56 14.43,3.86 10.12,3.86 9.54,4.45 9.54,6.18 8.05,7.67 8.05,8.46 6.24,10.28 v5.66,10.28 4.81,10.28 4.81,10.25 D-.TP
VBUS  (via drill 0.35)
  Top 0.254: 3.54,10.92 v3.54,14.41 | USB.A4B9 6.34,11.29 5.97,10.92 3.54,10.92 | 3.54,10.92 3.54,7.47 4.4,6.61 TP-5V.TP 4.94,6.51 5.05,6.63 6.45,6.63 6.59,6.49 USB.B4A9 7.71,6.49 7.84,6.62 v8.24,6.62 9.37,5.49 10.71,5.49 11.77,4.42 12.89,4.42 13.49,5.02 MDBT1.32 | MDBT1.32
  Bottom 0.254: v3.54,14.41 3.54,14.59 2.73,15.4 JP2.7 JP2.7C | v8.24,6.62 8.59,6.27 8.59,5.42 D1.A
VHI
  Bottom 0.254: R3.2 10.09,10.97 10.41,10.64 10.41,8.37 10.19,8.14 9.75,8.14 9.55,7.94 U1.1 9.55,7.71 9.7,7.56 10.78,7.56 11.15,7.19 12.27,7.19 | D1.C 12.27,7.18 12.27,7.19 | C4.2 13.32,7.19 12.27,7.19